# Altium schematic sheet MainPower.SchDoc
size A4
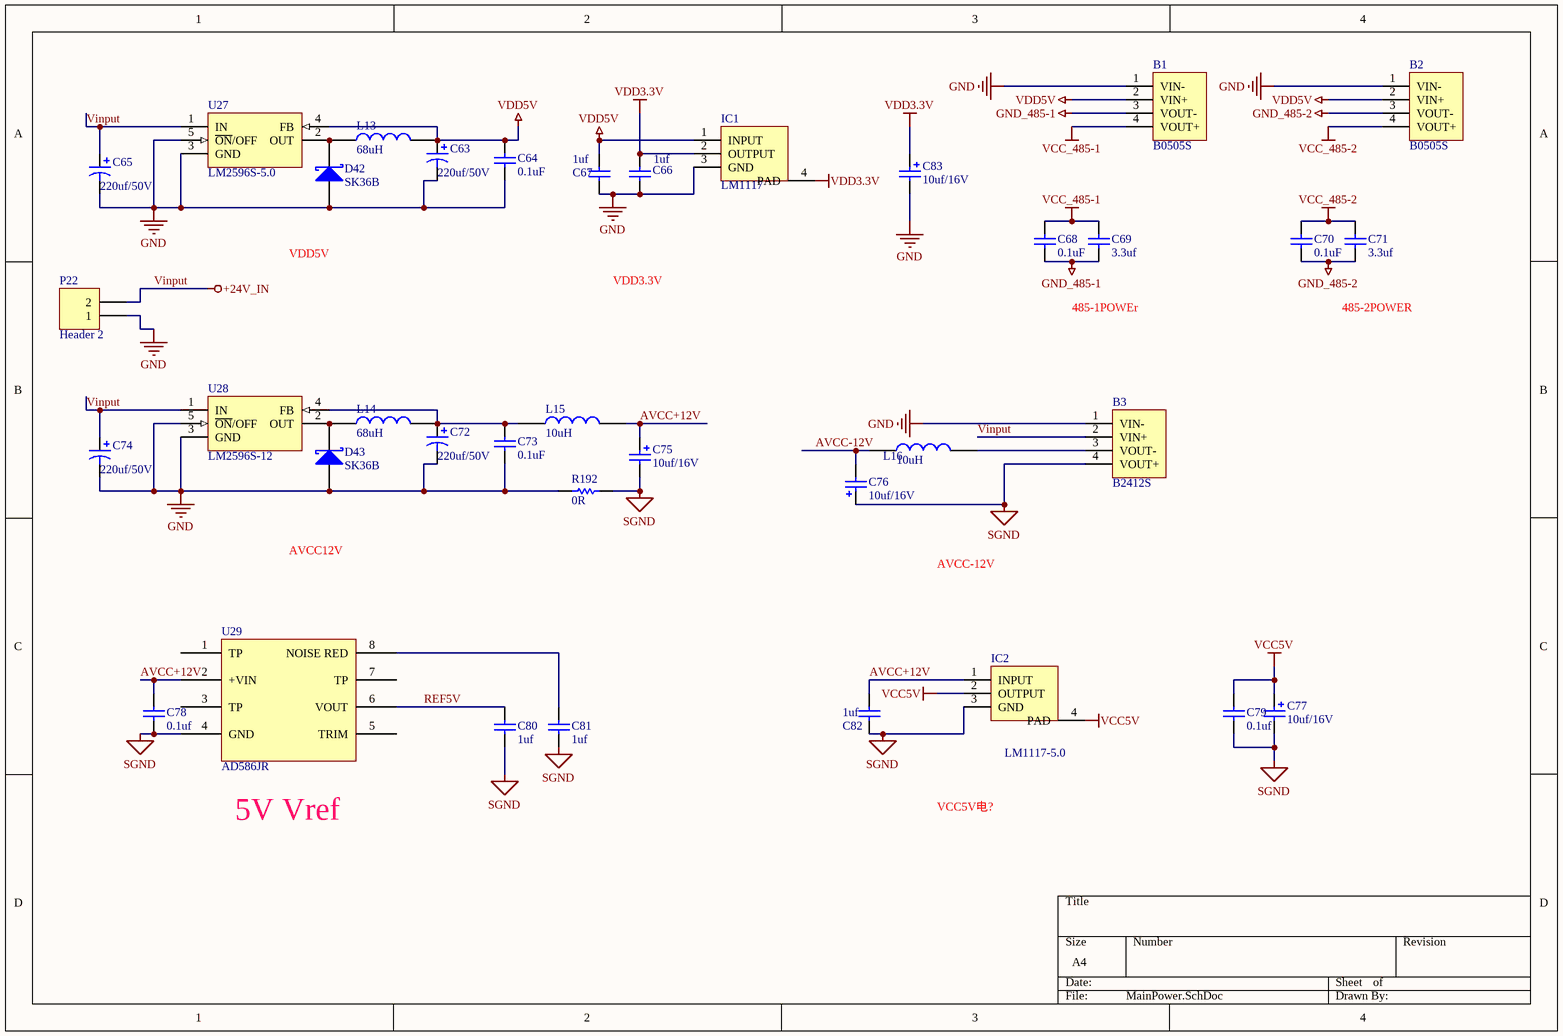
[diagram p0: MainPower.SchDoc]

## Parts
B1  B0505S  [B0505S]
B2  B0505S  [B0505S]
B3  B2412S  [B0505S]
C63  value 220uf/50V  [Cap5*10*12]  (hidden comment: Cap Pol1)
C64  value 0.1uF  [C0805]  (hidden comment: Cap)
C65  value 220uf/50V  [Cap5*10*12]  (hidden comment: Cap Pol1)
C66  value 1uf  [C0805]  (hidden comment: Cap)
C67  value 1uf  [C0805]  (hidden comment: Cap)
C68  value 0.1uF  [C0805]  (hidden comment: Cap)
C69  value 3.3uf  [C0805]  (hidden comment: Cap)
C70  value 0.1uF  [C0805]  (hidden comment: Cap)
C71  value 3.3uf  [C0805]  (hidden comment: Cap)
C72  value 220uf/50V  [Cap5*10*12]  (hidden comment: Cap Pol1)
C73  value 0.1uF  [C0805]  (hidden comment: Cap)
C74  value 220uf/50V  [Cap5*10*12]  (hidden comment: Cap Pol1)
C75  value 10uf/16V  [Cap-A]
C76  value 10uf/16V  [Cap-A]
C77  value 10uf/16V  [Cap-A]
C78  value 0.1uf  [C0805]  (hidden comment: Cap)
C79  value 0.1uf  [C0805]  (hidden comment: Cap)
C80  value 1uf  [C0805]  (hidden comment: Cap)
C81  value 1uf  [C0805]  (hidden comment: Cap)
C82  value 1uf  [C0805]  (hidden comment: Cap)
C83  value 10uf/16V  [Cap-A]
D42  SK36B  [SMB]
D43  SK36B  [SMB]
IC1  LM1117  [LM1117]
IC2  LM1117-5.0  [LM1117]
L13  68uH  [IND_HM00_12*12]
L14  68uH  [IND_HM00_12*12]
L15  10uH  [L1206]
L16  10uH  [L1206]
P22  Header 2  [JIEKE_2PX508]
R192  value 0R  [0805]  (hidden comment: Res Semi)
U27  LM2596S-5.0  [TS5B_M]
U28  LM2596S-12  [TS5B_M]
U29  AD586JR  [SOP8_M]

## Nets
GND: B1.1(VIN-) B2.1(VIN-) B3.1(VIN-) C63.2 C64.1 C65.2 C66.2 C67.2 C72.2 C73.1 C74.2 C83.2 D42.1(A) D43.1(A) IC1.3(GND) P22.1 R192.2 U27.3(GND) U27.5(~{ON}/OFF) U28.3(GND) U28.5(~{ON}/OFF)
GND_485-1: B1.3(VOUT-) C68.1 C69.1
GND_485-2: B2.3(VOUT-) C70.1 C71.1
SGND: B3.4(VOUT+) C75.2 C76.1 C77.2 C78.2 C79.2 C80.2 C81.2 C82.2 IC2.3(GND) R192.1 U29.4(GND)
VCC5V: C77.1 C79.1 IC2.2(OUTPUT) IC2.4(PAD)
VCC_485-1: B1.4(VOUT+) C68.2 C69.2
VCC_485-2: B2.4(VOUT+) C70.2 C71.2
VDD3.3V: C66.1 C83.1 IC1.2(OUTPUT) IC1.4(PAD)
VDD5V: B1.2(VIN+) B2.2(VIN+) C63.1 C64.2 C67.1 IC1.1(INPUT) L13.2 U27.4(FB)
Vinput: B3.2(VIN+) C65.1 C74.1 P22.2 U27.1(IN) U28.1(IN)  [also labelled +24V_IN]
AVCC+12V: C75.1 C78.1 C82.1 IC2.1(INPUT) L15.2 U29.2(+VIN)
AVCC-12V: C76.2 L16.1
REF5V: C80.1 U29.6(VOUT)
NetB3_3: B3.3(VOUT-) L16.2
NetC72_1: C72.1 C73.2 L14.2 L15.1 U28.4(FB)
NetC81_1: C81.1 U29.8(NOISE_RED)
NetD42_2: D42.2(K) L13.1 U27.2(OUT)
NetD43_2: D43.2(K) L14.1 U28.2(OUT)

Not connected (* = marked no-connect by the designer): U29 1(TP) 3(TP) 5(TRIM) 7(TP)

## Notes on the sheet
- VDD5V
- VDD3.3V
- 485-1POWEr
- 485-2POWER
- AVCC12V
- AVCC-12V
- 5V Vref
- VCC5V电?

## Library data of the parts
B3 = B0505S
C63 C65 C72 C74 = Cap Pol1: Polarized Capacitor (Radial); Published: 8-Jun-2000; LatestRevisionDate: 17-Jul-2002; LatestRevisionNote: Re-released for DXP Platform.; PackageReference: RB7.6-15; Publisher: Altium Limited
C64 C68-C71 C73 = Cap_2: Capacitor; Published: 8-Jun-2000; LatestRevisionDate: 17-Jul-2002; LatestRevisionNote: Re-released for DXP Platform.; Publisher: Altium Limited
C66 C67 C78-C82 = Cap: Capacitor; Manufacturer: Generic Components; Class: Passive; Published: 08/06/2000; Publisher: Altium Hobart Technology Centre; SubClass: Capacitor
C75-C77 C83 = Cap Pol2: Polarized Capacitor (Axial); Published: 8-Jun-2000; LatestRevisionDate: 17-Jul-2002; LatestRevisionNote: Re-released for DXP Platform.; PackageReference: POLAR0.8; Publisher: Altium Limited; PackageDescription: Polarized Capacitor; 2 Leads
D42 D43 = D Schottky: Schottky Diode; Published: 8-Jun-2000; LatestRevisionDate: 17-Jul-2002; LatestRevisionNote: Re-released for DXP Platform.; PackageReference: SMB; Publisher: Altium Limited; Code_JEDEC: DO-214-AA
IC2 = LM1117
L13-L16 = INDUCTOR
P22 = Header 2: Header, 2-Pin; LatestRevisionDate: 17-Jul-2002; LatestRevisionNote: Re-released for DXP Platform.; Publisher: Altium Limited
R192 = Res Semi: Semiconductor Resistor; Published: 8-Jun-2000; LatestRevisionDate: 17-Jul-2002; LatestRevisionNote: Re-released for DXP Platform.; PackageReference: AXIAL-0.5; Publisher: Altium Limited
U27 = LM2596S-5.0: Simple Switcher Power Converter 150 kHz 3A Step Down Voltage Regulator; Note: Tab is connected to GND; Published: 15-Apr-2002; DatasheetVersion: Dec-1997; PackageReference: TS5B; Publisher: Altium Limited; PackageDescription: D2-PAK; 5 Leads; Body 14.4 (inc. leads) x 10.4 mm (LxW max); ComponentLink1Description: Manufacturer Link; ComponentLink1URL: http://www.national.com/; ComponentLink2Description: Datasheet; ComponentLink2URL: http://www.national.com/ds.cgi/LM/LM2596.pdf; ComponentLink3Description: URL Link1; ComponentLink3URL: http://www.national.com/pf/LM/LM2596.html
U28 = LM2596S-12: Simple Switcher Power Converter 150 kHz 3A Step Down Voltage Regulator; Note: Tab is connected to GND; Published: 15-Apr-2002; DatasheetVersion: Dec-1997; PackageReference: TS5B; Publisher: Altium Limited; PackageDescription: D2-PAK; 5 Leads; Body 14.4 (inc. leads) x 10.4 mm (LxW max); ComponentLink1Description: Manufacturer Link; ComponentLink1URL: http://www.national.com/; ComponentLink2Description: Datasheet; ComponentLink2URL: http://www.national.com/ds.cgi/LM/LM2596.pdf; ComponentLink3Description: URL Link1; ComponentLink3URL: http://www.national.com/pf/LM/LM2596.html
U29 = AD586L